# EAGLE design PAPx2-44-bis (EAGLE 7.2.0)
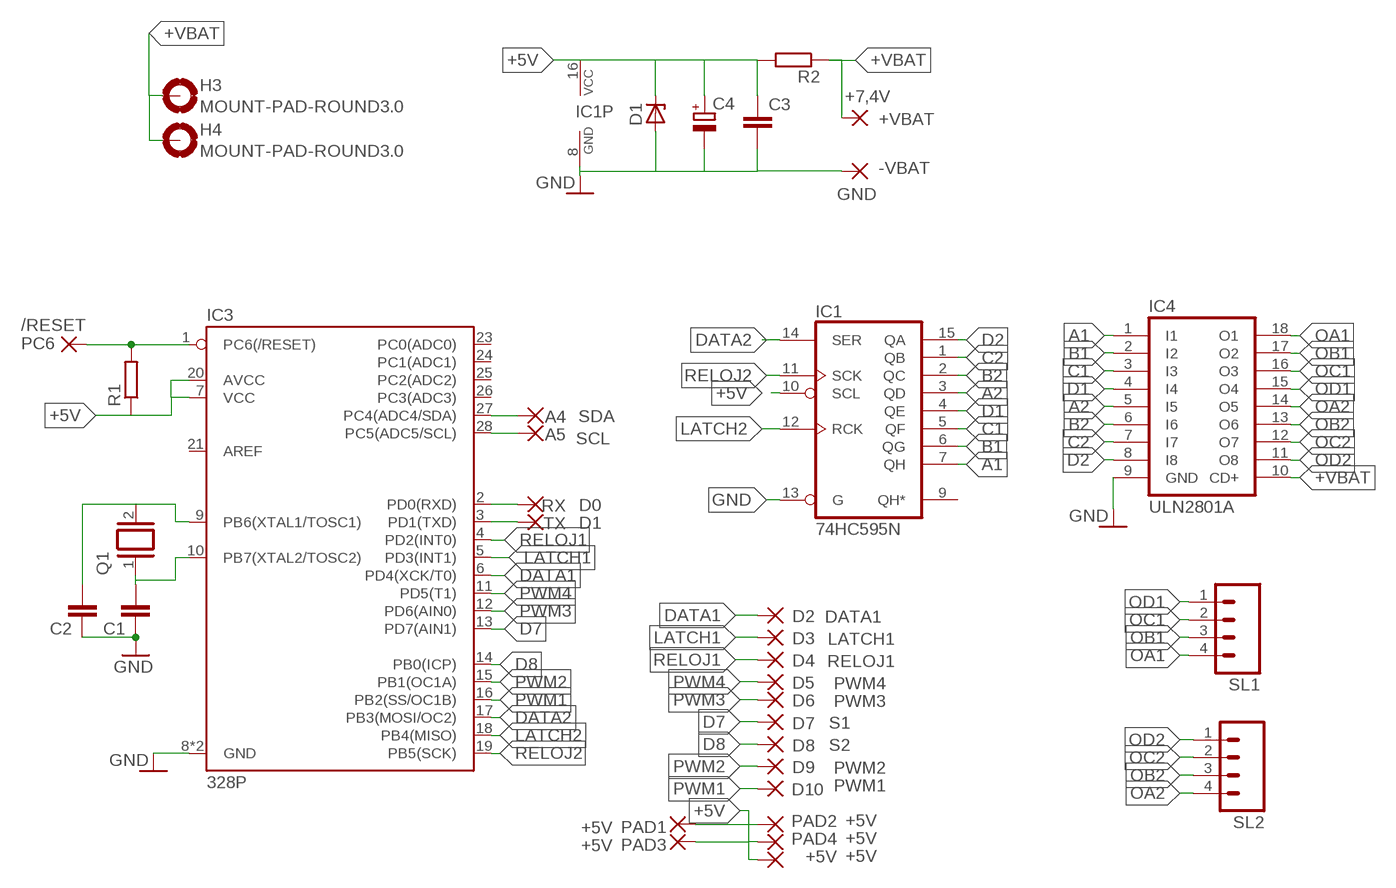
[diagram p0: schematic, sheet 1]

## Parts
+5V  +5V  WIREPAD1,6/0,8  [1,6/0,8]
+VBAT  +7,4V  WIREPAD1,6/0,8  [1,6/0,8]
-VBAT  GND  WIREPAD1,6/0,8  [1,6/0,8]
/RESET  PC6  WIREPAD1,6/0,8  [1,6/0,8]
A4  SDA  WIREPAD1,6/0,8  [1,6/0,8]
A5  SCL  WIREPAD1,6/0,8  [1,6/0,8]
C1  C-EU025-025X050  [C025-025X050]
C2  C-EU025-025X050  [C025-025X050]
C3  C-EU050-025X075  [C050-025X075]
C4  CPOL-EUE2.5-5  [E2,5-5]
D1  ZENER-DIODEZD-10  [ZDIO-10]
D7  S1  WIREPAD1,6/0,8  [1,6/0,8]
D8  S2  WIREPAD1,6/0,8  [1,6/0,8]
DATA1  D2  WIREPAD1,6/0,8  [1,6/0,8]
H3  MOUNT-PAD-ROUND3.0  [3,0-PAD]
H4  MOUNT-PAD-ROUND3.0  [3,0-PAD]
IC1  74HC595N  [DIL16]
IC3  328P  ATMEGA328P  [DIP28]
IC4  ULN2801A  [DIL18]
LATCH1  D3  WIREPAD1,6/0,8  [1,6/0,8]
PAD1  +5V  WIREPAD1,6/0,8  [1,6/0,8]
PAD2  +5V  WIREPAD1,6/0,8  [1,6/0,8]
PAD3  +5V  WIREPAD1,6/0,8  [1,6/0,8]
PAD4  +5V  WIREPAD1,6/0,8  [1,6/0,8]
PWM1  D10  WIREPAD1,6/0,8  [1,6/0,8]
PWM2  D9  WIREPAD1,6/0,8  [1,6/0,8]
PWM3  D6  WIREPAD1,6/0,8  [1,6/0,8]
PWM4  D5  WIREPAD1,6/0,8  [1,6/0,8]
Q1  XTAL/S  [QS]
R1  R-EU_0204/7  [0204/7]
R2  R-EU_0207/10  [0207/10]
RELOJ1  D4  WIREPAD1,6/0,8  [1,6/0,8]
RX  D0  WIREPAD1,6/0,8  [1,6/0,8]
SL1  M04  [04P]
SL2  M04  [04P]
TX  D1  WIREPAD1,6/0,8  [1,6/0,8]

## Nets
+5V: +5V.1(P) C4.+ D1.C IC1.10(SCL) IC1.16(VCC) IC3.7(VCC) IC3.20(AVCC) PAD1.1(P) PAD2.1(P) PAD3.1(P) PAD4.1(P) R1.1
+VBAT: +VBAT.1(P) H3.B3,0(MOUNT) H4.B3,0(MOUNT) IC4.10(CD+) R2.1
A1: IC1.7(QH) IC4.1(I1)
A2: IC1.3(QD) IC4.5(I5)
B1: IC1.6(QG) IC4.2(I2)
B2: IC1.2(QC) IC4.6(I6)
C1: IC1.5(QF) IC4.3(I3)
C2: IC1.1(QB) IC4.7(I7)
D1: IC1.4(QE) IC4.4(I4)
D2: IC1.15(QA) IC4.8(I8)
D7: D7.1(P) IC3.13(PD7(AIN1))
D8: D8.1(P) IC3.14(PB0(ICP))
DATA1: DATA1.1(P) IC3.6(PD4(XCK/T0))
DATA2: IC1.14(SER) IC3.17(PB3(MOSI/OC2))
GND: -VBAT.1(P) C1.1 C2.1 C3.2 C4.- D1.A IC1.8(GND) IC1.13(G) IC3.8(GND) IC3.22(GND) IC4.9(GND)
LATCH1: IC3.5(PD3(INT1)) LATCH1.1(P)
LATCH2: IC1.12(RCK) IC3.18(PB4(MISO))
N$1: IC3.2(PD0(RXD)) RX.1(P)
N$2: IC3.3(PD1(TXD)) TX.1(P)
N$3: /RESET.1(P) IC3.1(PC6(/RESET)) R1.2
N$4: C1.2 IC3.10(PB7(XTAL2/TOSC2)) Q1.1
N$5: A4.1(P) IC3.27(PC4(ADC4/SDA))
N$6: A5.1(P) IC3.28(PC5(ADC5/SCL))
N$7: C2.2 IC3.9(PB6(XTAL1/TOSC1)) Q1.2
N$8: C3.1 R2.2
OA1: IC4.18(O1) SL1.4
OA2: IC4.14(O5) SL2.4
OB1: IC4.17(O2) SL1.3
OB2: IC4.13(O6) SL2.3
OC1: IC4.16(O3) SL1.2
OC2: IC4.12(O7) SL2.2
OD1: IC4.15(O4) SL1.1
OD2: IC4.11(O8) SL2.1
PWM1: IC3.16(PB2(SS/OC1B)) PWM1.1(P)
PWM2: IC3.15(PB1(OC1A)) PWM2.1(P)
PWM3: IC3.12(PD6(AIN0)) PWM3.1(P)
PWM4: IC3.11(PD5(T1)) PWM4.1(P)
RELOJ1: IC3.4(PD2(INT0)) RELOJ1.1(P)
RELOJ2: IC1.11(SCK) IC3.19(PB5(SCK))
Unconnected: IC1.9(QH*) IC3.21(AREF) IC3.23(PC0(ADC0)) IC3.24(PC1(ADC1)) IC3.25(PC2(ADC2)) IC3.26(PC3(ADC3))

## Library data of the parts
+5V +VBAT -VBAT /RESET A4 A5 D7 D8 DATA1 LATCH1 PAD1-PAD4 PWM1-PWM4 RELOJ1 RX TX = wirepad:WIREPAD: Wire PAD connect wire on PCB
C1-C3 = rcl:C-EU: CAPACITOR, European symbol
C4 = rcl:CPOL-EU: POLARIZED CAPACITOR, European symbol
D1 = diode:ZENER-DIODE: Z-Diode
H3 H4 = holes:MOUNT-PAD-ROUND: MOUNTING PAD, round
IC1 = 74xx-eu:74*595: 8-bit SHIFT REGISTER, output latch
IC3 = treser_lib:ATMEGA328P: Atmel ATMEGA328P 32kb flash, 1k EEPROM, 2k SRAM; PROD_ID: IC-09136
IC4 = uln-udn:ULN2801A: DRIVER ARRAY
Q1 = special:XTAL/S: CRYSTAL
R1 R2 = resistor:R-EU_: RESISTOR, European symbol
SL1 SL2 = con-amp-quick:M04: AMP QUICK CONNECTOR; OC_FARNELL: unknown; OC_NEWARK: unknown

## Board
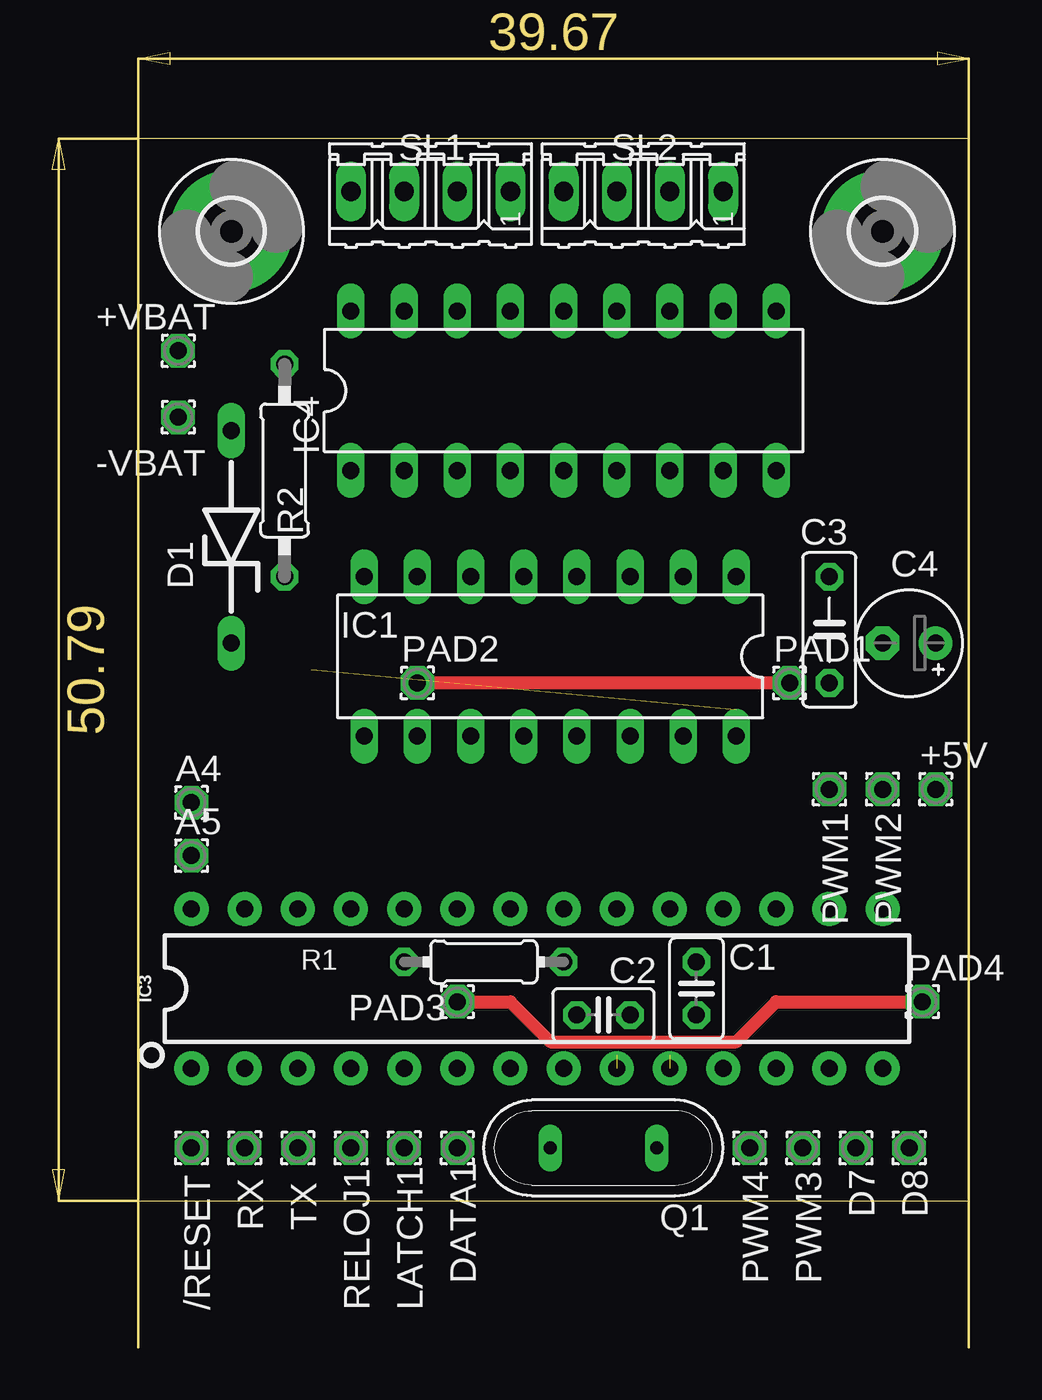
[diagram p1: board, top side]
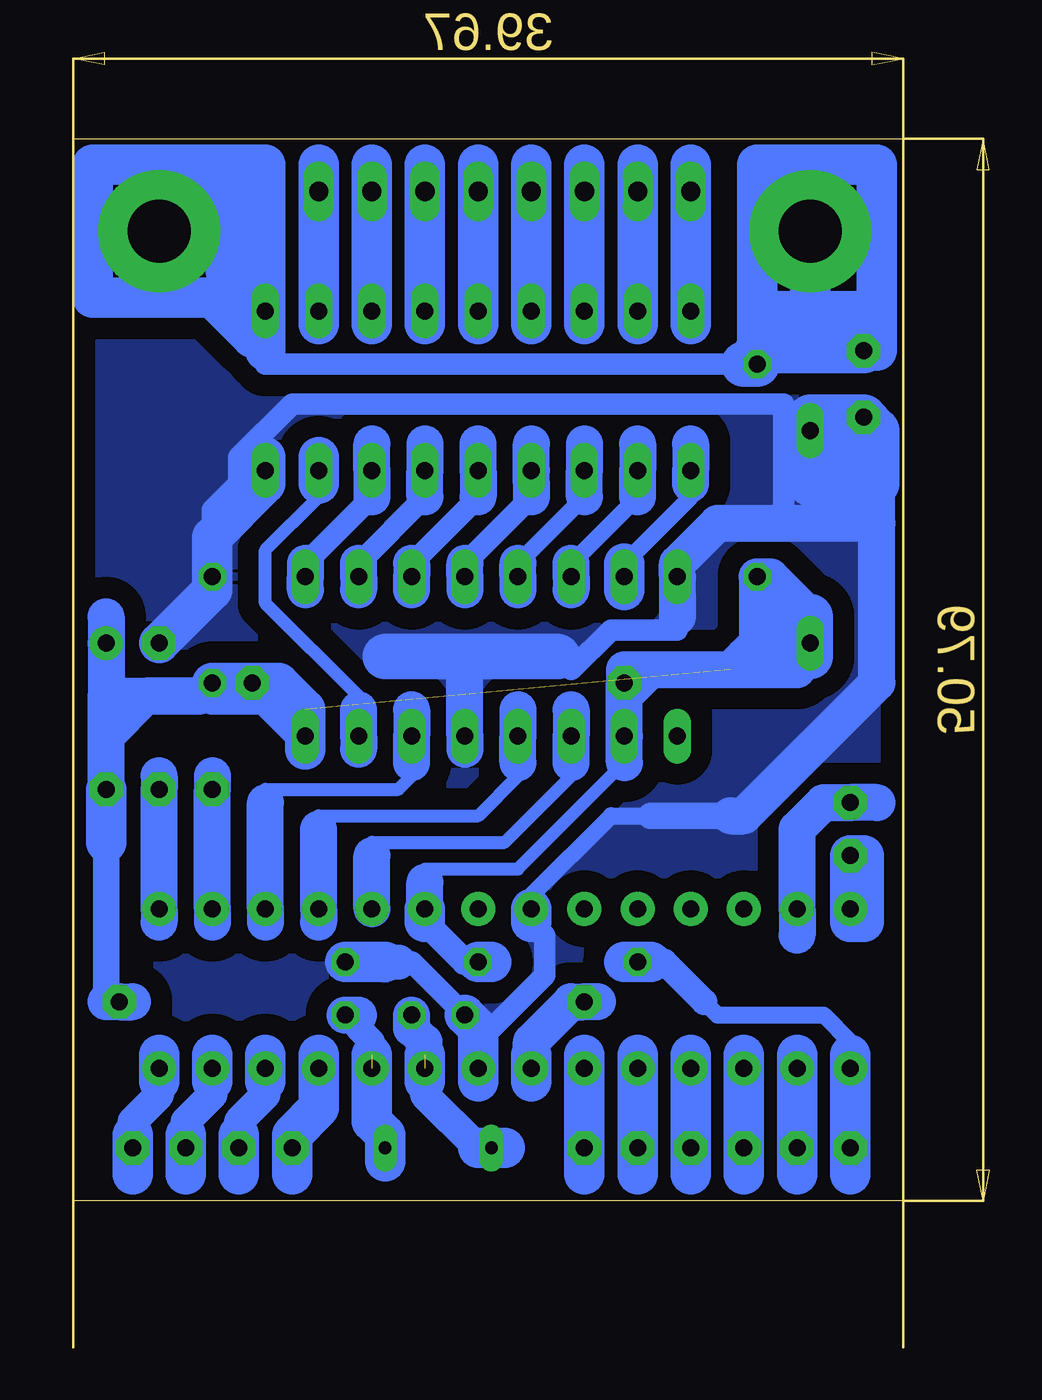
[diagram p2: board, bottom side, seen from below]

Size 39.67 x 50.79 mm. Coordinates in mm from the lower left corner, seen from the top.
Outline: 0,0 39.67,0 39.67,50.79 0,50.79 0,0
Copper layers (1*16): Top 0.035mm / dielectric 1.5mm / Bottom 0.035mm
Design rules "default": minimum track width 10mil, minimum drill 24mil, track to track 8mil, track to pad 8mil, pad to pad 8mil, via to via 8mil, smd to smd 8mil, copper to edge 40mil, drill to drill 8mil, minimum pad ring 10mil, minimum via ring 8mil, stop-mask expansion 4mil, vias tented up to drill 0mil, thermal gap 10mil

### Footprints (pad centres in the part's own frame; a part is rotated, then mirrored left to right if it is on the bottom)
1,6/0,8 = drill 0.813 pad 1.6 octagon: 1 0,0
C025-025X050 = drill 0.813 octagon: 1 -1.27,0; 2 1.27,0
C050-025X075 = drill 0.813 octagon: 1 -2.54,0; 2 2.54,0
E2,5-5 = drill 0.813 pad 1.6: + -1.27,0 | drill 0.813 pad 1.6 octagon: - 1.27,0
ZDIO-10 = drill 0.813 long: A 5.08,0; C -5.08,0
3,0-PAD = drill 3 pad 5.842: B3,0 0,0
DIL16 = drill 0.813 long: 1 -8.89,-3.81; 2 -6.35,-3.81; 3 -3.81,-3.81; 4 -1.27,-3.81; 5 1.27,-3.81; 6 3.81,-3.81; 7 6.35,-3.81; 8 8.89,-3.81; 9 8.89,3.81; 10 6.35,3.81; 11 3.81,3.81; 12 1.27,3.81; 13 -1.27,3.81; 14 -3.81,3.81; 15 -6.35,3.81; 16 -8.89,3.81
DIP28 = drill 0.813 pad 1.626: 1 -16.51,-3.81; 2 -13.97,-3.81; 3 -11.43,-3.81; 4 -8.89,-3.81; 5 -6.35,-3.81; 6 -3.81,-3.81; 7 -1.27,-3.81; 8 1.27,-3.81; 9 3.81,-3.81; 10 6.35,-3.81; 11 8.89,-3.81; 12 11.43,-3.81; 13 13.97,-3.81; 14 16.51,-3.81; 15 16.51,3.81; 16 13.97,3.81; 17 11.43,3.81; 18 8.89,3.81; 19 6.35,3.81; 20 3.81,3.81; 21 1.27,3.81; 22 -1.27,3.81; 23 -3.81,3.81; 24 -6.35,3.81; 25 -8.89,3.81; 26 -11.43,3.81; 27 -13.97,3.81; 28 -16.51,3.81
DIL18 = drill 0.813 long: 1 -10.16,-3.81; 2 -7.62,-3.81; 3 -5.08,-3.81; 4 -2.54,-3.81; 5 0,-3.81; 6 2.54,-3.81; 7 5.08,-3.81; 8 7.62,-3.81; 9 10.16,-3.81; 10 10.16,3.81; 11 7.62,3.81; 12 5.08,3.81; 13 2.54,3.81; 14 0,3.81; 15 -2.54,3.81; 16 -5.08,3.81; 17 -7.62,3.81; 18 -10.16,3.81
QS = drill 0.61 long: 1 -2.54,0; 2 2.54,0
0204/7 = drill 0.813 octagon: 1 -3.81,0; 2 3.81,0
0207/10 = drill 0.813 octagon: 1 -5.08,0; 2 5.08,0
04P = drill 0.914 long: 1 -3.81,0; 2 -1.27,0; 3 1.27,0; 4 3.81,0

### Placement (x,y rotation side)
+5V  38.1,19.69 0 top
+VBAT  1.91,40.64 0 top
-VBAT  1.91,37.47 0 top
/RESET  2.54,2.54 0 top
A4  2.54,19.05 0 top
A5  2.54,16.51 0 top
C1  26.67,10.16 270 top
C2  22.23,8.89 0 top
C3  33.02,27.3 90 top
C4  36.83,26.67 180 top
D1  4.45,31.75 90 top
D7  34.29,2.54 0 top
D8  36.83,2.54 0 top
DATA1  15.24,2.54 0 top
H3  35.56,46.36 0 top
H4  4.45,46.36 0 top
IC1  19.68,26.04 180 top
IC3  19.05,10.16 0 top
IC4  20.32,38.73 0 top
LATCH1  12.7,2.54 0 top
PAD1  31.11,24.77 0 top
PAD2  13.34,24.77 0 top
PAD3  15.24,9.53 0 top
PAD4  37.47,9.53 0 top
PWM1  33.02,19.69 0 top
PWM2  35.56,19.69 0 top
PWM3  31.75,2.54 0 top
PWM4  29.21,2.54 0 top
Q1  22.23,2.54 180 top
R1  16.51,11.43 180 top
R2  6.99,34.92 270 top
RELOJ1  10.16,2.54 0 top
RX  5.08,2.54 0 top
SL1  13.97,48.26 180 top
SL2  24.13,48.26 180 top
TX  7.62,2.54 0 top

### Tracks (layer width: path | path; a pad name or v marks a point on that pad's centre or on a via)
+5V
  Top 0.61: PAD1.1 PAD2.1 | PAD3.1 17.78,9.53 19.68,7.62 28.57,7.62 30.48,9.53 PAD4.1
  Bottom 0.61: 22.86,15.24 22.86,15.88 18.41,15.88 13.34,20.96
  Bottom 1.27: 38.1,9.53 38.1,17.14 | 19.68,11.43 20.95,11.43 22.86,13.34
  Bottom 1.778: IC3.20 22.86,15.24 | 13.34,20.96 IC1.10 13.34,24.13 | 13.34,24.13 PAD2.1 13.34,25.4 12.06,25.4 | +5V.1 38.1,24.13 | 38.1,27.94 C4.+ 38.1,24.13 | 36.83,9.53 PAD4.1 38.1,9.53 | 13.34,24.13 12.06,25.4 | 12.06,25.4 5.08,25.4 4.45,26.04 | 38.1,24.13 33.66,24.13 33.02,24.77 | 17.78,6.99 17.78,7.62 15.88,9.53 PAD3.1 14.61,9.53
  Bottom 1.93: 38.1,17.14 +5V.1 | 28.57,21.59 IC1.16 28.57,23.5 29.84,24.77 PAD1.1 33.02,24.77 | R1.1 19.68,11.43 | 22.86,13.34 IC3.20 | 17.78,5.71 IC3.7 17.78,6.99
  Bottom 2.184: 4.45,26.04 D1.C 4.45,27.94
+VBAT
  Bottom 1.016: 30.48,40.64 30.48,40.01 7.62,40.01
  Bottom 1.93: 30.48,40.64 IC4.10 30.48,49.53 38.73,49.53 38.73,43.18 33.02,43.18 31.11,41.27 31.11,43.18 32.38,44.45 32.38,47.62 31.75,48.26 33.66,48.26 H3.B3,0 | 6.99,40.64 6.99,49.53 1.27,49.53 1.27,42.55 | 1.27,40.64 1.27,42.55 | 1.27,42.55 4.45,42.55 | 6.35,42.55 4.45,42.55 | 4.45,42.55 H4.B3,0
  Bottom 2.184: 7.62,40.01 R2.1 6.99,40.64 +VBAT.1
A1
  Bottom 0.813: 13.34,30.48 10.16,33.66 10.16,34.29
  Bottom 1.778: 10.16,34.29 IC4.1 10.16,36.2
  Bottom 1.93: 13.34,29.21 IC1.7 13.34,30.48
A2
  Bottom 1.016: 20.32,33.66 23.5,30.48
  Bottom 1.778: 20.32,36.2 IC4.5 20.32,33.66 | 23.5,30.48 IC1.3 23.5,29.21
B1
  Bottom 0.813: 15.88,29.21 15.88,30.48 12.7,33.66
  Bottom 1.778: 15.88,30.48 IC1.6 15.88,29.21 | 12.7,33.66 IC4.2 12.7,36.2
B2
  Bottom 1.016: 26.04,30.48 22.86,33.66
  Bottom 1.778: 26.04,29.21 IC1.2 26.04,30.48 | 22.86,33.66 IC4.6 22.86,36.2
C1
  Bottom 0.813: 18.41,30.48 15.24,33.66
  Bottom 1.778: 18.41,29.21 IC1.5 18.41,30.48 | 15.24,33.66 IC4.3 15.24,36.2
C2
  Bottom 1.016: 25.4,33.66 28.57,30.48
  Bottom 1.778: 25.4,36.2 IC4.7 25.4,33.66 | 28.57,30.48 IC1.1 28.57,29.21
D1
  Bottom 1.016: 20.95,30.48 17.78,33.66
  Bottom 1.778: 20.95,29.21 IC1.4 20.95,30.48 | 17.78,34.29 IC4.4 | IC4.4 17.78,36.2 | 17.78,34.29 17.78,33.66 | 17.78,34.29 IC4.4
D2
  Bottom 0.61: 26.04,23.5 26.04,24.13 30.48,28.58 30.48,31.12 27.94,33.66 27.94,34.29
  Bottom 1.778: 26.04,21.59 IC1.15 26.04,23.5
  Bottom 1.93: 27.94,34.29 IC4.8 27.94,35.56
D7
  Bottom 1.422: 33.02,5.71 33.02,5.08 34.29,3.81 34.29,3.17
  Bottom 1.93: 33.02,6.99 IC3.13 33.02,5.71 | 34.29,3.17 D7.1 34.29,1.27
D8
  Bottom 1.422: 36.83,3.17 36.83,3.81 35.56,5.08 35.56,5.71
  Bottom 1.93: 36.83,1.27 D8.1 36.83,3.17 | 35.56,5.71 IC3.14 35.56,6.99
DATA1
  Bottom 1.93: 15.24,1.27 DATA1.1 IC3.6 15.24,6.99
DATA2
  Bottom 0.61: 30.48,19.05 30.48,19.69 24.13,19.69 23.5,20.32 23.5,20.96
  Bottom 1.778: 30.48,13.34 IC3.17 30.48,19.05 | 23.5,20.96 IC1.14 23.5,23.5
GND
  Bottom 0.813: 10.79,27.94 10.79,27.3 | IC3.22 17.78,14.61 13.97,18.41 12.06,18.41
  Bottom 1.016: 16.51,26.04 15.88,25.4 13.97,27.3 10.79,27.3 | 24.13,11.43 23.5,11.43 C2.1 | 17.78,13.34 17.14,12.7 17.14,10.8 20.32,7.62 | 33.02,29.21 33.02,33.02 31.75,34.29 31.75,35.56 29.21,38.1 5.71,38.1 5.71,33.02 5.08,32.38
  Bottom 1.27: 12.06,18.41 8.26,18.41
  Bottom 1.676: 24.77,11.43 24.13,11.43
  Bottom 1.778: 10.79,27.94 IC1.8 10.79,30.48 8.89,32.38 5.08,32.38 1.27,32.38 | 20.95,21.59 IC1.13 20.95,26.04 | 8.26,18.41 7.62,18.41 1.27,24.77 1.27,32.38 | 1.27,32.38 1.27,34.29
  Bottom 1.93: 30.48,35.56 IC4.9 30.48,34.29 33.02,31.75 C3.2 33.02,29.21 C4.- | 20.32,5.71 IC3.8 20.32,7.62 20.32,8.25 C2.1 | C1.1 24.77,11.43 | IC3.22 17.78,13.34
  Bottom 2.184: 24.77,26.04 20.95,26.04 16.51,26.04 | -VBAT.1 4.45,37.47 D1.A | D1.A 4.45,34.29 1.27,34.29 1.27,36.83 -VBAT.1 | -VBAT.1 1.91,36.83 3.17,35.56 D1.A
  pour Bottom (isolate 1.016): 0,6.99 39.37,6.99 39.37,42.55 0,42.55
LATCH1
  Bottom 1.93: 12.7,6.99 IC3.5 LATCH1.1 12.7,1.27
LATCH2
  Bottom 0.61: 27.94,17.78 27.94,18.41 20.32,18.41 18.41,20.32 18.41,20.96
  Bottom 1.778: 27.94,13.34 IC3.18 27.94,17.78 | 18.41,20.96 IC1.12 18.41,23.5
N$1
  Bottom 1.93: 5.08,6.99 IC3.2 RX.1 5.08,1.27
N$2
  Bottom 1.93: 7.62,1.27 TX.1 IC3.3 7.62,6.99
N$3
  Bottom 0.813: 2.54,6.99 2.54,7.62 3.81,8.89 8.89,8.89 9.53,9.53
  Bottom 1.27: 12.06,11.43 11.43,11.43 9.53,9.53
  Bottom 1.93: 2.54,1.27 /RESET.1 IC3.1 2.54,6.99 | 13.34,11.43 R1.2 12.06,11.43
N$4  (1 unrouted)
  Bottom 1.27: 26.04,8.89 26.04,8.25 25.4,7.62 25.4,6.99
  Bottom 1.778: C1.2 26.04,8.89
  Bottom 1.93: 25.4,6.99 25.4,3.81 24.77,3.17 Q1.1 24.77,1.91
N$5
  Bottom 1.778: 5.08,12.7 IC3.27 5.08,17.78 3.81,19.05 A4.1 1.27,19.05
N$6
  Bottom 1.93: IC3.28 2.54,13.34 1.91,13.34 1.91,16.51 A5.1 IC3.28
N$7  (1 unrouted)
  Bottom 1.422: 20.32,2.54 22.86,5.08 22.86,5.71
  Bottom 1.676: 22.86,6.99 22.86,7.62 23.5,8.25
  Bottom 1.778: 23.5,8.25 C2.2
  Bottom 1.93: 19.05,2.54 Q1.2 20.32,2.54 | 22.86,5.71 22.86,6.99
N$8  (1 unrouted)
  Bottom 1.778: 36.2,24.13 33.66,24.13 C3.1 33.02,24.13 30.48,24.13 28.57,22.23 28.57,23.5 29.84,24.77 31.11,24.77 | 38.1,24.13 36.2,24.13 | 36.2,24.13 38.1,22.23 | R2.2 6.99,26.67 | 6.99,26.67 7.62,26.04 | 7.62,26.04 5.71,26.04 5.71,28.58 R2.2 | R2.2 6.35,29.84 4.45,27.94 4.45,26.67 6.99,26.67 | 7.62,26.04 8.26,25.4
OA1
  Bottom 1.93: 10.16,41.91 IC4.18 SL1.4 10.16,49.53
OA2
  Bottom 1.93: 20.32,49.53 SL2.4 IC4.14 20.32,41.91
OB1
  Bottom 1.93: 12.7,41.91 IC4.17 SL1.3 12.7,49.53
OB2
  Bottom 1.93: 22.86,41.91 IC4.13 SL2.3 22.86,49.53
OC1
  Bottom 1.93: 15.24,49.53 SL1.2 IC4.16 15.24,41.91
OC2
  Bottom 1.93: 25.4,41.91 IC4.12 SL2.2 25.4,49.53
OD1
  Bottom 1.93: 17.78,41.91 IC4.15 SL1.1 17.78,49.53
OD2
  Bottom 1.93: 27.94,49.53 SL2.1 IC4.11 27.94,41.91
PWM1
  Bottom 1.778: 33.02,13.34 IC3.16 PWM1.1 33.02,20.32
PWM2
  Bottom 1.778: 35.56,13.34 IC3.15 PWM2.1 35.56,20.32
PWM3
  Bottom 1.422: 31.75,3.17 31.75,3.81 30.48,5.08 30.48,5.71
  Bottom 1.93: 31.75,1.27 PWM3.1 31.75,3.17 | 30.48,5.71 IC3.12 30.48,6.99
PWM4
  Bottom 1.93: 29.21,1.27 PWM4.1 29.21,3.17 27.94,4.44 IC3.11 27.94,6.99
RELOJ1
  Bottom 1.93: 10.16,6.99 IC3.4 RELOJ1.1 10.16,1.27
RELOJ2
  Bottom 0.61: 25.4,16.51 25.4,17.14 19.05,17.14 15.88,20.32 15.88,20.96
  Bottom 1.778: IC3.19 25.4,16.51 | 15.88,20.96 IC1.11 15.88,23.5